# Altium schematic sheet USB.SchDoc
size A4; SheetNumber: 6; SheetTotal: 7
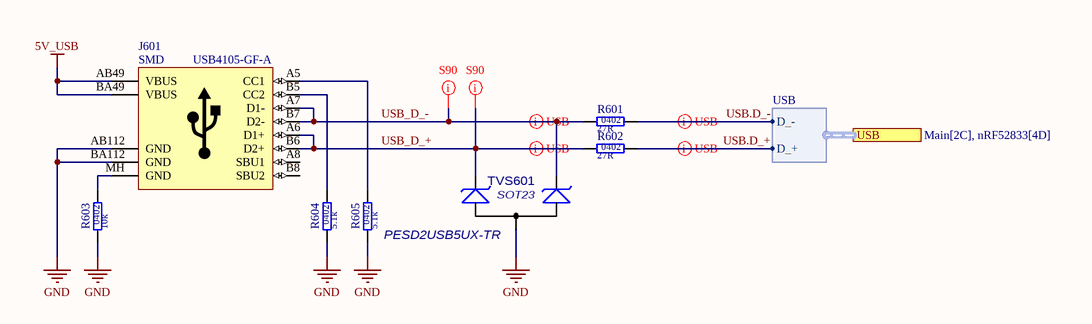
[diagram p0: USB.SchDoc]

## Parts
J601  value USB4105-GF-A  SCH_Footprint: SMD  [J_USB_C_USB4105]  (hidden comment: USB C Connector)
R601  value 27R  SCH_Footprint: 0402  [R_0402_1005]  (hidden comment: Resistor)
R602  value 27R  SCH_Footprint: 0402  [R_0402_1005]  (hidden comment: Resistor)
R603  value 10k  SCH_Footprint: 0402  [R_0402_1005]  (hidden comment: Resistor)
R604  value 5.1k  SCH_Footprint: 0402  [R_0402_1005]  (hidden comment: Resistor)
R605  value 5.1k  SCH_Footprint: 0402  [R_0402_1005]  (hidden comment: Resistor)
TVS601  value PESD2USB5UX-TR  SCH_Footprint: SOT23  [SOT23_N]  (hidden comment: TVS dual low capacitance)

## Ports
USB (harness USB, see Main[2C], nRF52833[4D])

## Harnesses
USB: D_-, D_+

## Nets
5V_USB: J601.AB49(VBUS) J601.BA49(VBUS)
GND: J601.AB112(GND) J601.BA112(GND) R603.1 R604.1 R605.1 TVS601.3
USB.D_+: R602.2 ; port USB.D_+
USB.D_-: R601.2 ; port USB.D_-
USB_D_+: J601.A6(D1+) J601.B6(D2+) R602.1 TVS601.2
USB_D_-: J601.A7(D1-) J601.B7(D2-) R601.1 TVS601.1
NetJ601_A5: J601.A5(CC1) R605.2
NetJ601_B5: J601.B5(CC2) R604.2
NetJ601_MH: J601.MH(GND) R603.2

Not connected (* = marked no-connect by the designer): J601 A8(SBU1) B8(SBU2)

## Layout directives
differential pair: USB_D_+, USB_D_-
differential pair; rule Supply Nets [Voltage = 5.000]: USB.D_+, USB.D_-
net class S90: USB_D_+, USB_D_-

## Notes on the sheet
- Title:
- Sheet:
- of
- Author:
- Model:
- Document Number:
- Checked by:
- Iss-Rev:
- Approved by:
- Date:
- File name:

## Library data of the parts
J601 = J_USB_C_USB4105-GF-A: Manufacturer: GCT; Part Number: J_USB_C_USB4105-GF-A; HelpURL: https://www.mouser.pl/datasheet/2/837/USB4105-2888174.pdf; Manufacturer Part Number: USB4105-GF-A; Supplier 1: TME; Supplier 2: RS Components; Supplier 3: Farnell; Supplier Part Number 3: 3588205; Supplier 4: Mouser; Supplier Part Number 4: 640-USB4105-GF-A; Supplier 5: Digi-Key; Supplier Part Number 5: 2073-USB4105-GF-ACT-ND; Supplier 6: LCSC
R601 R602 = R_27R_0402_1: Manufacturer: Vishay; Manufacturer Part Number: CRCW040227R0FKED; Voltage: 50V; Power: 63mW; Tolerance: 1%; Part Number: R_27R_0402_1; HelpURL: http://datasheet.octopart.com/CRCW040227R0FKED-Vishay-datasheet-66077789.pdf; Supplier 1: TME; Supplier 2: RS Components; Supplier Part Number 2: 6789052; Supplier 3: Farnell; Supplier Part Number 3: 2140614; Supplier 4: Mouser; Supplier Part Number 4: 71-CRCW040227R0FKED; Supplier 5: Digi-Key; Supplier Part Number 5: 541-27.0LCT-ND; Supplier 6: LCSC
R603 = R_10k_0402_1: Manufacturer: Yageo; Manufacturer Part Number: RC0402FR-0710KL; Voltage: 50V; Power: 63mW; Tolerance: 1%; Part Number: R_10k_0402_1; HelpURL: http://www.tme.eu/pl/Document/1a2bc76e2be68b3b1670068306778ce6/rc0402yageo.pdf; Supplier 1: TME; Supplier Part Number 1: RC0402FR-0710K; Supplier 2: RS Components; Supplier 3: Farnell; Supplier 4: Mouser; Supplier 5: Digi-Key; Supplier 6: LCSC
R604 R605 = R_5.1k_0402_1: Manufacturer: Yageo; Manufacturer Part Number: RC0402FR-075K1L; Voltage: 50V; Power: 63mW; Tolerance: 1%; Part Number: R_5.1k_0402_1; HelpURL: https://www.tme.eu/Document/92d375a0b5e7ae71098c0026a66a663c/RC0201FR-07100KL.PDF; Supplier 1: TME; Supplier Part Number 1: RC0402FR-075K1L; Supplier 2: RS Components; Supplier Part Number 2: 1987836; Supplier 3: Farnell; Supplier Part Number 3: 1458805; Supplier 4: Mouser; Supplier Part Number 4: 603-RC0402FR-075K1L; Supplier 5: Digi-Key; Supplier Part Number 5: 311-5.10KLRCT-ND; Supplier 6: LCSC
TVS601 = TVS_PESD2USB5UX-TR: Manufacturer: Nexperia; Voltage: 5.0V; Current: 8A; Part Number: TVS_PESD2USB5UX-TR; HelpURL: https://assets.nexperia.com/documents/data-sheet/PESD2USB5UX-T.pdf; Manufacturer Part Number: PESD2USB5UX-TR; Supplier 1: TME; Supplier 2: RS Components; Supplier 3: Farnell; Supplier 4: Mouser; Supplier Part Number 4: 771-PESD2USB5UX-TR; Supplier 5: Digi-Key; Supplier Part Number 5: 1727-PESD2USB5UX-CT-ND; Supplier 6: LCSC